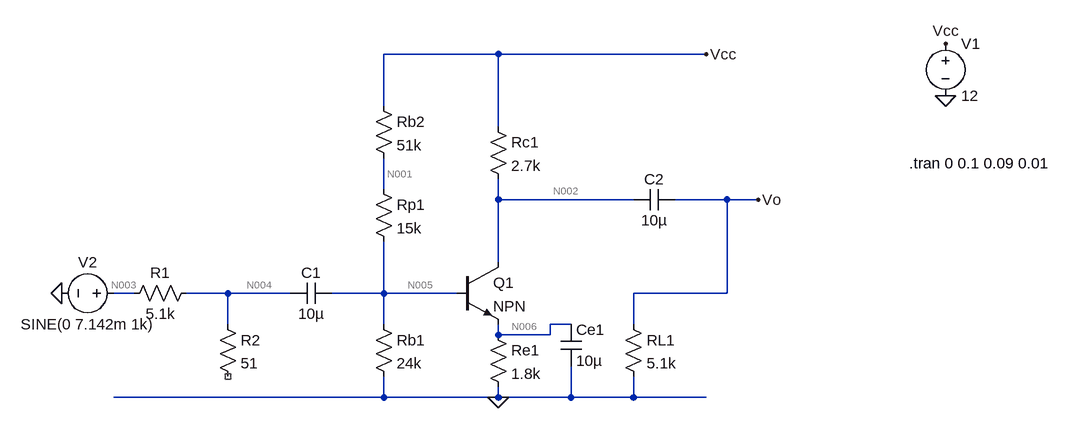
[diagram p0: schematic Experiment2_4_1.asc]
Experiment2_4_1.asc, the LTspice schematic file:
Version 4.1
SHEET 1 904 680
WIRE 32 -32 -144 -32
WIRE 352 -32 32 -32
WIRE -144 48 -144 -32
WIRE 32 80 32 -32
WIRE -144 176 -144 128
WIRE 32 192 32 160
WIRE 240 192 32 192
WIRE 384 192 304 192
WIRE 432 192 384 192
WIRE 32 288 32 192
WIRE -528 336 -560 336
WIRE -384 336 -448 336
WIRE -288 336 -384 336
WIRE -144 336 -144 256
WIRE -144 336 -224 336
WIRE -32 336 -144 336
WIRE 384 336 384 192
WIRE 384 336 240 336
WIRE -384 384 -384 336
WIRE -144 384 -144 336
WIRE 144 384 112 384
WIRE 240 384 240 336
WIRE 32 400 32 384
WIRE 112 400 112 384
WIRE 112 400 32 400
WIRE -144 496 -144 464
WIRE -144 496 -560 496
WIRE 32 496 32 480
WIRE 32 496 -144 496
WIRE 144 496 144 448
WIRE 144 496 32 496
WIRE 240 496 240 464
WIRE 240 496 144 496
WIRE 352 496 240 496
FLAG 32 496 0
FLAG 352 -32 Vcc
FLAG 720 -48 Vcc
FLAG 720 32 0
FLAG 432 192 Vo
FLAG -640 336 0
SYMBOL res -432 320 R90
WINDOW 0 0 56 VBottom 2
WINDOW 3 32 56 VTop 2
SYMATTR InstName R1
SYMATTR Value 5.1k
SYMBOL res -400 368 R0
SYMATTR InstName R2
SYMATTR Value 51
SYMBOL res -160 368 R0
SYMATTR InstName Rb1
SYMATTR Value 24k
SYMBOL res -160 160 R0
SYMATTR InstName Rp1
SYMATTR Value 15k
SYMBOL res -160 32 R0
SYMATTR InstName Rb2
SYMATTR Value 51k
SYMBOL npn -32 288 R0
SYMATTR InstName Q1
SYMBOL res 16 384 R0
SYMATTR InstName Re1
SYMATTR Value 1.8k
SYMBOL res 224 368 R0
SYMATTR InstName RL1
SYMATTR Value 5.1k
SYMBOL res 16 64 R0
SYMATTR InstName Rc1
SYMATTR Value 2.7k
SYMBOL voltage 720 -64 R0
WINDOW 123 0 0 Left 0
WINDOW 39 0 0 Left 0
SYMATTR InstName V1
SYMATTR Value 12
SYMBOL cap -224 320 R90
WINDOW 0 0 32 VBottom 2
WINDOW 3 32 32 VTop 2
SYMATTR InstName C1
SYMATTR Value 10µ
SYMATTR SpiceLine V=6.3 Irms=0 Rser=4 Lser=0 mfg="AVX" pn="TAJA106M006" type="Tantalum"
SYMBOL cap 240 208 R270
WINDOW 0 32 32 VTop 2
WINDOW 3 0 32 VBottom 2
SYMATTR InstName C2
SYMATTR Value 10µ
SYMATTR SpiceLine V=6.3 Irms=0 Rser=4 Lser=0 mfg="AVX" pn="TAJA106M006" type="Tantalum"
SYMBOL cap 128 384 R0
SYMATTR Value 10µ
SYMATTR InstName Ce1
SYMATTR SpiceLine V=6.3 Irms=0 Rser=4 Lser=0 mfg="AVX" pn="TAJA106M006" type="Tantalum"
SYMBOL voltage -544 336 R90
WINDOW 0 -32 56 VBottom 2
WINDOW 3 32 56 VTop 2
WINDOW 123 0 0 Left 0
WINDOW 39 0 0 Left 0
SYMATTR InstName V2
SYMATTR Value SINE(0 7.142m 1k)
TEXT 664 136 Left 2 !.tran 0 0.1 0.09 0.01

The netlist it stands for:
* Experiment2_4_1.asc
R1 N004 N003 5.1k
R2 N004 NC_01 51
Rb1 N005 0 24k
Rp1 N001 N005 15k
Rb2 Vcc N001 51k
Q1 N002 N005 N006 0 NPN
Re1 N006 0 1.8k
RL1 Vo 0 5.1k
Rc1 Vcc N002 2.7k
V1 Vcc 0 12
C1 N005 N004 10µ V=6.3 Irms=0 Rser=4 Lser=0 mfg="AVX" pn="TAJA106M006" type="Tantalum"
C2 N002 Vo 10µ V=6.3 Irms=0 Rser=4 Lser=0 mfg="AVX" pn="TAJA106M006" type="Tantalum"
Ce1 N006 0 10µ V=6.3 Irms=0 Rser=4 Lser=0 mfg="AVX" pn="TAJA106M006" type="Tantalum"
V2 N003 0 SINE(0 7.142m 1k)
.model NPN NPN
.model PNP PNP
.lib standard.bjt
.tran 0 0.1 0.09 0.01
.backanno
.end

* Results of the author's LTspice run, read from the files saved beside the schematic
* Operating Point, zero values left out:
*   V(n005) = 2.986 V
*   V(n001) = 5.035 V
*   V(n002) = 8.722 V
*   V(vcc) = 12 V
*   V(n006) = 2.207 V
*   Ic(Q1) = 1.214 mA
*   Ib(Q1) = 12.14 µA
*   Ie(Q1) = -1.226 mA
*   I(Rb1) = 124.4 µA
*   I(Rb2) = 136.6 µA
*   I(Rp1) = 136.6 µA
*   I(Re1) = 1.226 mA
*   I(V1) = -1.351 mA
*   I(Rc1) = 1.214 mA
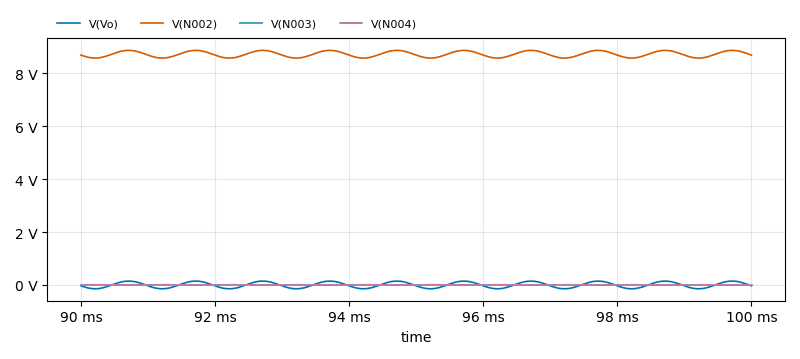
[diagram p1: Transient Analysis of Experiment2_4_1.asc, plotted from the saved traces]
* Transient Analysis, 1 run:
*   V(Vo): min -146.5 mV, max 145.2 mV, average 29.13 µV, rms 103.1 mV, last -34.6 mV
*   V(N002): min 8.575 V, max 8.867 V, average 8.722 V, rms 8.723 V, last 8.688 V
*   V(N003): min -7.142 mV, max 7.141 mV, average 158.1 nV, rms 5.054 mV, last 0 V
*   V(N004): min -2.494 mV, max 2.494 mV, average 1.303 µV, rms 1.765 mV, last -771.5 µV